# EAGLE design LZ3003_2 (EAGLE 7.7.0)
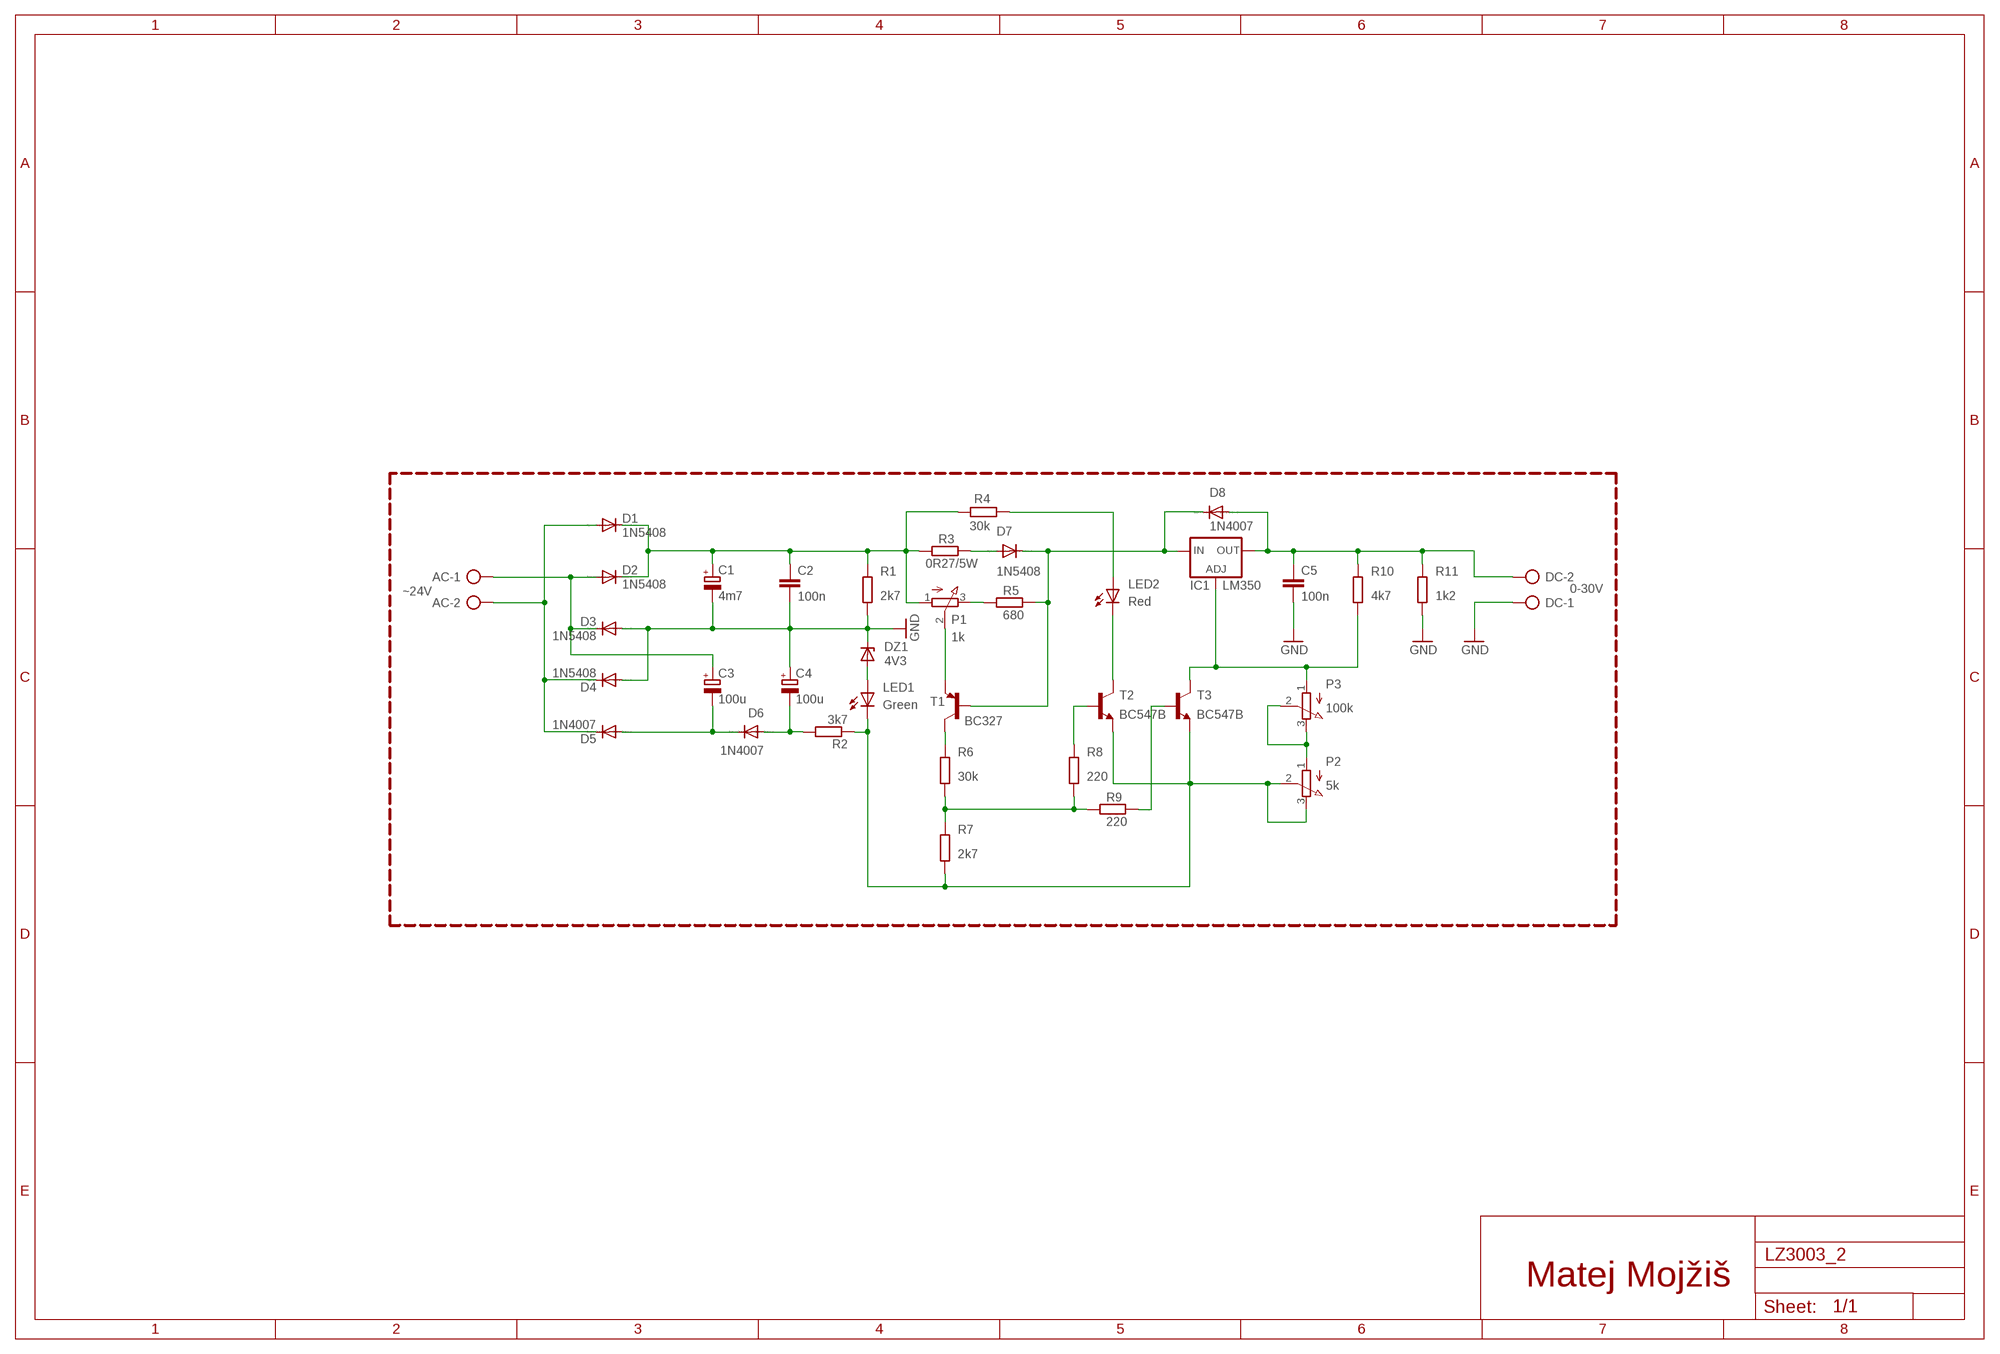
[diagram p0: schematic, sheet 1]

## Parts
AC  ~24V  W237-102  [W237-102]
C1  4m7  CPOL-EUE7.5-16  [E7,5-16]
C2  100n  C-EU050-025X075  [C050-025X075]
C3  100u  CPOL-EUE5-8.5  [E5-8,5]
C4  100u  CPOL-EUE5-8.5  [E5-8,5]
C5  100n  C-EU050-025X075  [C050-025X075]
D1  1N5408  1N5400  [DO201-15]
D2  1N5408  1N5400  [DO201-15]
D3  1N5408  1N5400  [DO201-15]
D4  1N5408  1N5400  [DO201-15]
D5  1N4007  1N4004  [DO41-10]
D6  1N4007  1N4004  [DO41-10]
D7  1N5408  1N5400  [DO201-15]
D8  1N4007  1N4004  [DO41-10]
DC  0-30V  W237-102  [W237-102]
DZ1  4V3  ZENER-DIODEDO34-7  [DO34Z7]
IC1  LM350  LM317TS  [317TS]
LED1  Green  LED5MM  [LED5MM]
LED2  Red  LED5MM  [LED5MM]
P1  1k  3RP/1610N  [3RP/1610N]
P2  5k  3RP/1610N  [3RP/1610N]
P3  100k  3RP/1610N  [3RP/1610N]
R1  2k7  R-EU_0207/7  [0207/7]
R2  3k7  R-EU_0207/7  [0207/7]
R3  0R27/5W  R-EU_0617/22  [0617/22]
R4  30k  R-EU_0207/7  [0207/7]
R5  680  R-EU_0207/7  [0207/7]
R6  30k  R-EU_0207/7  [0207/7]
R7  2k7  R-EU_0207/7  [0207/7]
R8  220  R-EU_0207/7  [0207/7]
R9  220  R-EU_0207/7  [0207/7]
R10  4k7  R-EU_0207/7  [0207/7]
R11  1k2  R-EU_0207/7  [0207/7]
T1  BC327  [TO92-EBC]
T2  BC547B  BC547B-NPN-TO92-CBE  [TO92-CBE]
T3  BC547B  BC547B-NPN-TO92-CBE  [TO92-CBE]

## Nets
GND: C1.- C2.2 C4.+ C5.2 D3.A D4.A DC.1 DZ1.C R1.2 R11.1
N$1: C3.- D5.A D6.C
N$2: D7.A R3.2
N$3: AC.1 C3.+ D2.A D3.C
N$4: P1.3(E) R5.1
N$5: AC.2 D1.A D4.C D5.C
N$6: C4.- D6.A R2.2
N$7: DZ1.A LED1.A
N$8: LED1.K(C) P2.2(S) P2.3(E) R2.1 R7.1 T2.E T3.E
N$9: C1.+ C2.1 D1.C D2.C P1.1(A) R1.1 R3.1 R4.2
N$10: P1.2(S) T1.E
N$11: R6.2 T1.C
N$12: R6.1 R7.2 R8.1 R9.1
N$13: R9.2 T3.B
N$14: R8.2 T2.B
N$16: P2.1(A) P3.2(S) P3.3(E)
N$20: LED2.A R4.1
N$21: D7.C D8.C IC1.3(IN) R5.2 T1.B
N$22: LED2.K(C) T2.C
N$24: C5.1 D8.A DC.2 IC1.2(OUT) R10.2 R11.2
N$26: IC1.1(ADJ) P3.1(A) R10.1 T3.C

## Notes on the sheet
- Matej Mojžiš

## Library data of the parts
AC DC = con-wago-500:W237-102: WAGO SCREW CLAMP; MPN: 237-102; OC_FARNELL: unknown; OC_NEWARK: 70K9898
C1 C3 C4 = rcl:CPOL-EU: POLARIZED CAPACITOR, European symbol
C2 C5 = rcl:C-EU: CAPACITOR, European symbol
D1-D4 D7 = diode:1N5400: DIODE standard rectifier, 3 A, 50 V (Motorola)
D5 D6 D8 = diode:1N4004: DIODE general purpose rectifier, 1 A
DZ1 = diode:ZENER-DIODE: Z-Diode
IC1 = v-reg:LM317TS: VOLTAGE REGULATOR
LED1 LED2 = led:LED: LED OSRAM: - CHIPLED LG R971, LG N971, LY N971, LG Q971, LY Q971, LO R971, LY R971 LH N974, LH R974 LS Q976, LO Q976, LY Q976 LO Q996 - Hyper CHIPLED LW Q18S LB Q993, LB Q99A, LB R99A - SideLED LS A670, LO A670, LY A670, LG A670, LP A670 LB A673, LV A673, LT A673, LW A673 LH A674 LY A675 LS A676, LA A676, LO A676, LY A676, LW A676 LS A679, LY A679, LG A679 - Hyper Micro SIDELED® LS Y876, LA Y876, LO Y876, LY Y876 LT Y87S - SmartLED LW L88C, LW L88S LB L89C, LB L89S, LG L890 LS L89K, LO L89K, LY L89K LS L896, LA L896, LO L896, LY L896 - TOPLED LS T670, LO T670, LY T670, LG T670, LP T670 LSG T670, LSP T670, LSY T670, LOP T670, LYG T670 LG T671, LOG T671, LSG T671 LB T673, LV T673, LT T673, LW T673 LH T674 LS T676, LA T676, LO T676, LY T676, LB T676, LH T676, LSB T676, LW T676 LB T67C, LV T67C, LT T67C, LS T67K, LO T67K, LY T67K, LW E67C LS E67B, LA E67B, LO E67B, LY E67B, LB E67C, LV E67C, LT E67C LW T67C LS T679, LY T679, LG T679 LS T770, LO T770, LY T770, LG T770, LP T770 LB T773, LV T773, LT T773, LW T773 LH T774 LS E675, LA E675, LY E675, LS T675 LS T776, LA T776, LO T776, LY T776, LB T776 LHGB T686 LT T68C, LB T68C - Hyper Mini TOPLED® LB M676 - Mini TOPLED Santana® LG M470 LS M47K, LO M47K, LY M47K Source: http://www.osram.convergy.de LUXEON: - LUMILED® LXK2-PW12-R00, LXK2-PW12-S00, LXK2-PW14-U00, LXK2-PW14-V00 LXK2-PM12-R00, LXK2-PM12-S00, LXK2-PM14-U00 LXK2-PE12-Q00, LXK2-PE12-R00, LXK2-PE12-S00, LXK2-PE14-T00, LXK2-PE14-U00 LXK2-PB12-K00, LXK2-PB12-L00, LXK2-PB12-M00, LXK2-PB14-N00, LXK2-PB14-P00, LXK2-PB14-Q00 LXK2-PR12-L00, LXK2-PR12-M00, LXK2-PR14-Q00, LXK2-PR14-R00 LXK2-PD12-Q00, LXK2-PD12-R00, LXK2-PD12-S00 LXK2-PH12-R00, LXK2-PH12-S00 LXK2-PL12-P00, LXK2-PL12-Q00, LXK2-PL12-R00 Source: www.luxeon.com KINGBRIGHT: KA-3528ASYC Source: www.kingbright.com
P1-P3 = pot:3RP/1610N: 16mm Potentiometer one level Source: http://www.alphapotentiometers.net/html/16mm_pot_2.html
R1-R11 = rcl:R-EU_: RESISTOR, European symbol
T1 = transistor-pnp:BC327*: PNP Transistror
T2 T3 = transistor:*-NPN-: NPN Transistror BF959 corrected 2008.03.06

## Board
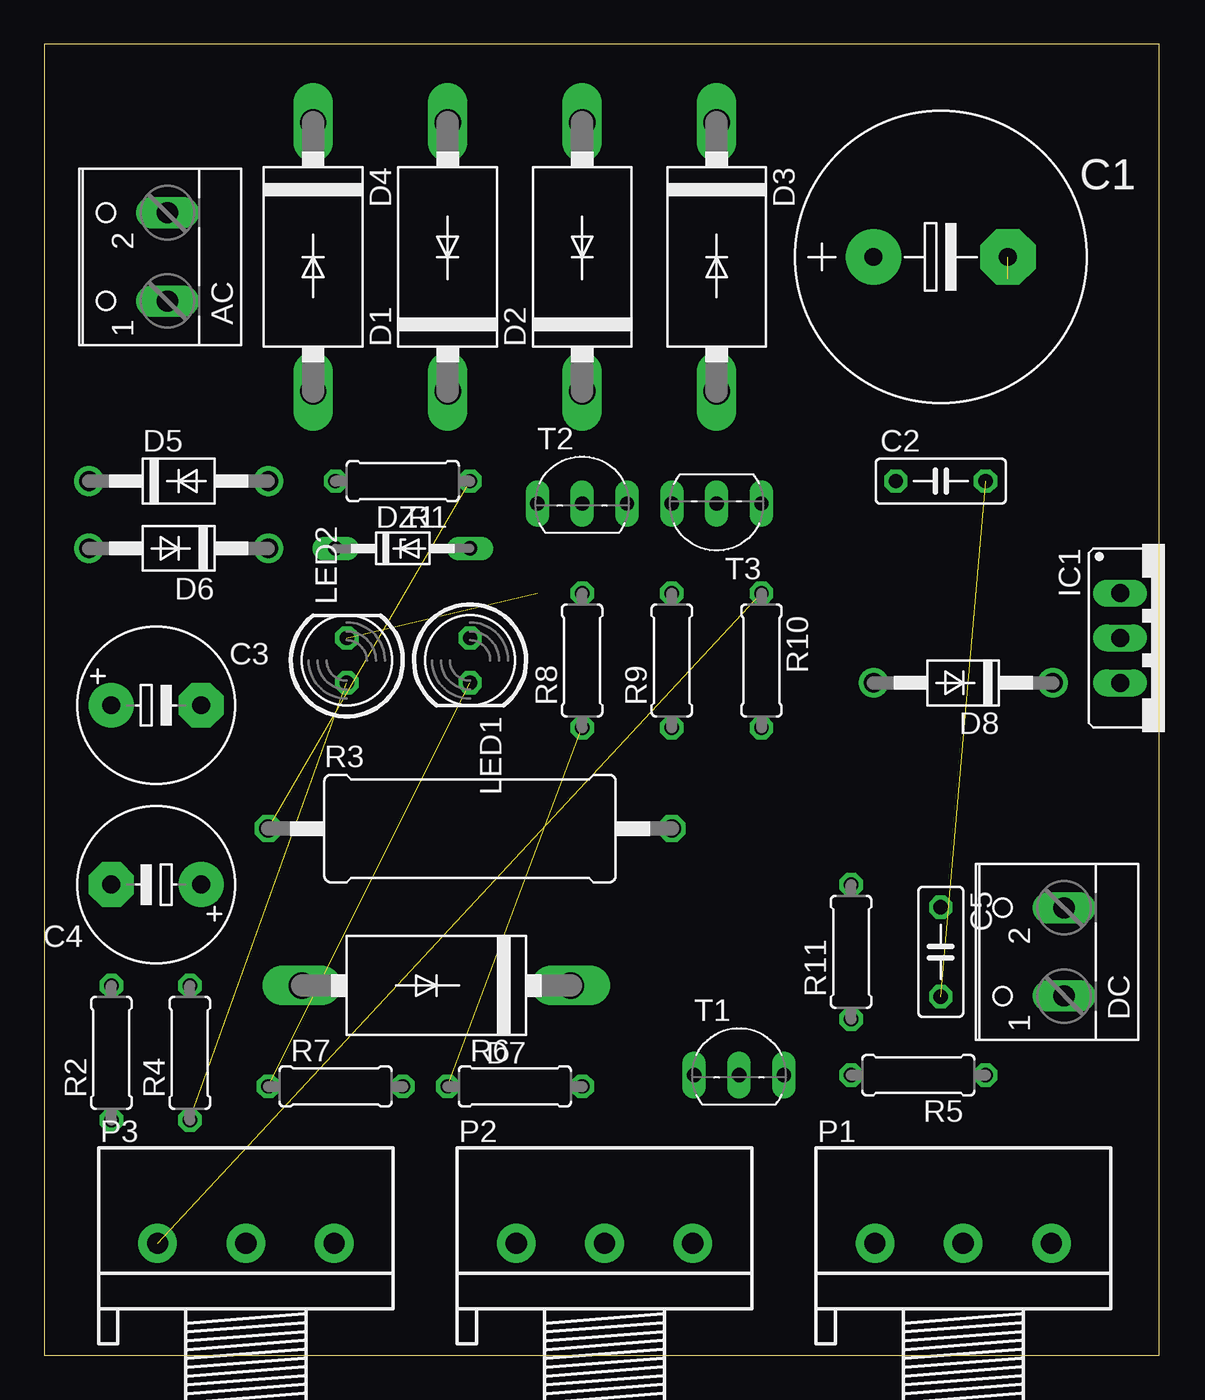
[diagram p1: board, top side]
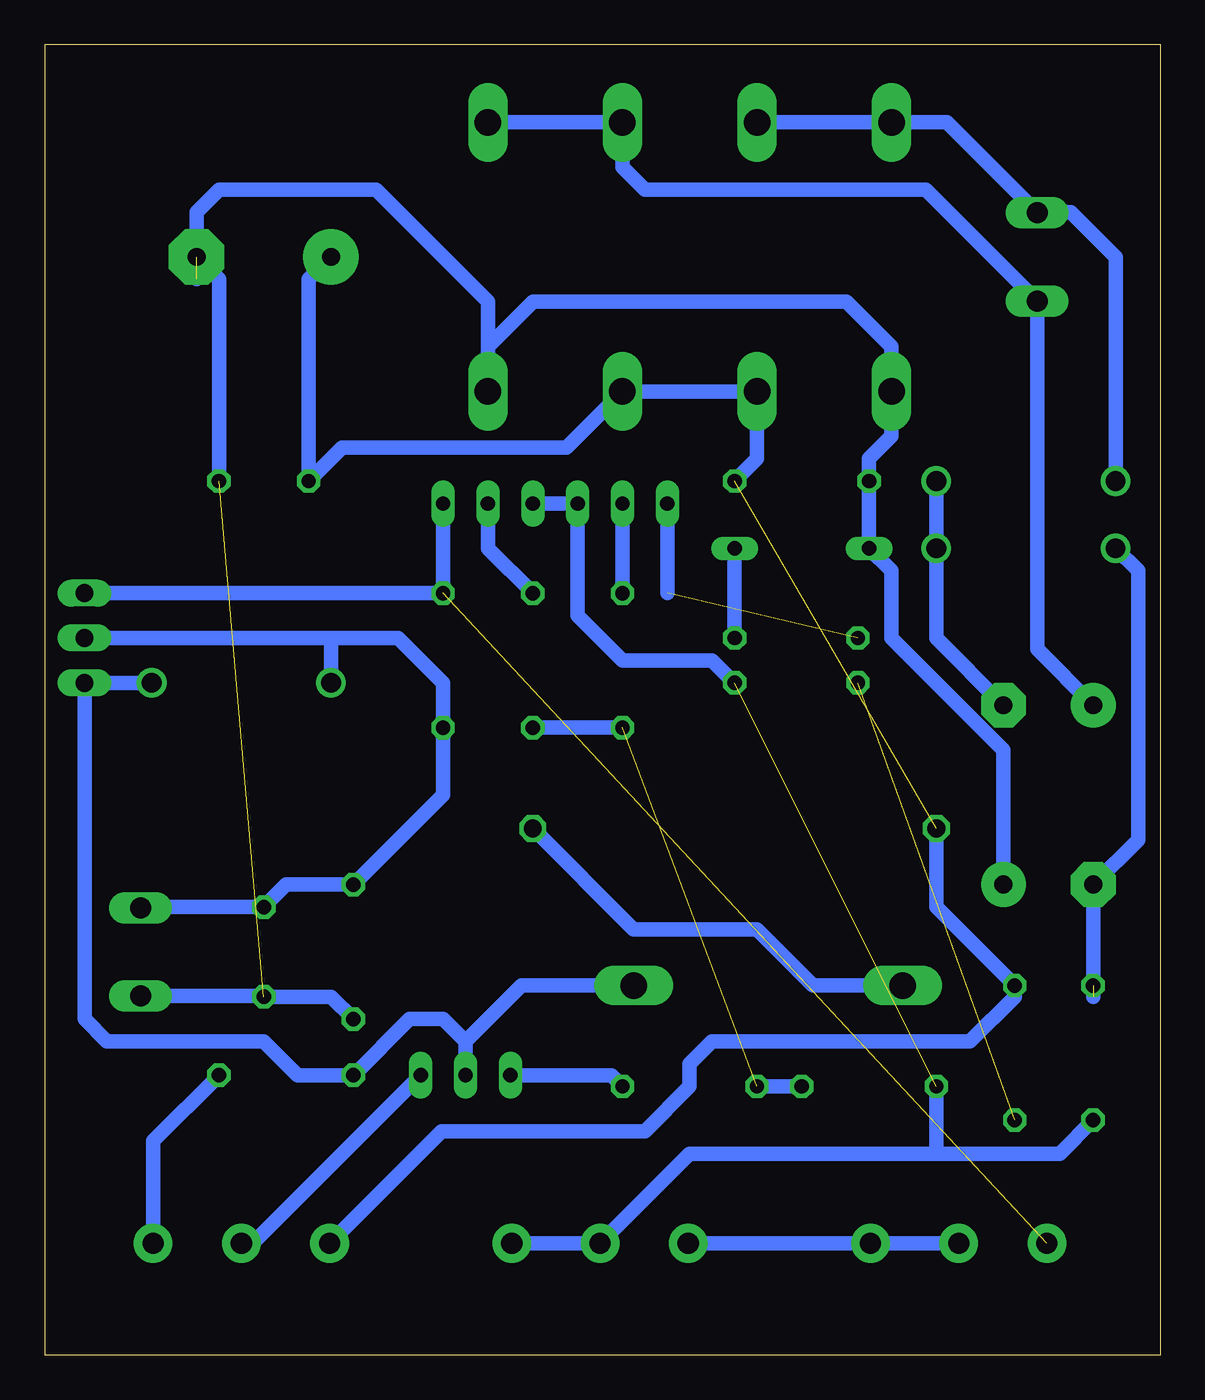
[diagram p2: board, bottom side, seen from below]

Size 63.17 x 74.28 mm. Coordinates in mm from the lower left corner, seen from the top.
Outline: 0,0 63.17,0 63.17,74.28 0,74.28 0,0
Copper layers (1*16): Top 0.035mm / dielectric 1.5mm / Bottom 0.035mm
Design rules "default": minimum track width 10mil, minimum drill 24mil, track to track 8mil, track to pad 8mil, pad to pad 8mil, via to via 8mil, smd to smd 8mil, copper to edge 40mil, drill to drill 8mil, minimum pad ring 10mil, minimum via ring 8mil, stop-mask expansion 4mil, vias tented up to drill 0mil, thermal gap 10mil

### Footprints (pad centres in the part's own frame; a part is rotated, then mirrored left to right if it is on the bottom)
W237-102 = drill 1.194 long: 1 -2.5,-1.27; 2 2.5,-1.27
E7,5-16 = drill 1.016 pad 3.15: + -3.81,0 | drill 1.016 pad 3.15 octagon: - 3.81,0
C050-025X075 = drill 0.813 octagon: 1 -2.54,0; 2 2.54,0
E5-8,5 = drill 1.016 pad 2.54: + -2.54,0 | drill 1.016 pad 2.54 octagon: - 2.54,0
DO201-15 = drill 1.499 long: A 7.62,0; C -7.62,0
DO41-10 = drill 1.118: A 5.08,0; C -5.08,0
DO34Z7 = drill 0.813 long: A 3.81,0; C -3.81,0
317TS = drill 1.016 long: 1 -2.54,-2.54; 2 0,-2.54; 3 2.54,-2.54
LED5MM = drill 0.813 octagon: A -1.27,0; K 1.27,0
3RP/1610N = drill 1.2 pad 2.184: 1 -5,0; 2 0,0; 3 5,0
0207/7 = drill 0.813 octagon: 1 -3.81,0; 2 3.81,0
0617/22 = drill 1.016 octagon: 1 -11.43,0; 2 11.43,0
TO92-EBC = drill 0.813 long: B 0,-1.27; C -2.54,-1.27; E 2.54,-1.27
TO92-CBE = drill 0.813 long: B 0,0; C -2.54,0; E 2.54,0

### Placement (x,y rotation side)
AC  5.71,62.23 90 top
C1  50.8,62.23 0 top
C2  50.8,49.53 0 top
C3  6.35,36.83 0 top
C4  6.35,26.67 180 top
C5  50.8,22.86 270 top
D1  22.86,62.23 90 top
D2  30.48,62.23 90 top
D3  38.1,62.23 270 top
D4  15.24,62.23 270 top
D5  7.62,49.53 0 top
D6  7.62,45.72 180 top
D7  22.23,20.95 180 top
D8  52.07,38.1 180 top
DC  56.52,22.86 90 top
DZ1  20.32,45.72 0 top
IC1  63.5,40.64 270 top
LED1  24.13,39.37 270 top
LED2  17.14,39.37 90 top
P1  52.07,6.35 0 top
P2  31.75,6.35 0 top
P3  11.43,6.35 0 top
R1  20.32,49.53 180 top
R2  3.81,17.14 90 top
R3  24.13,29.84 0 top
R4  8.26,17.14 90 top
R5  49.53,15.88 180 top
R6  26.67,15.24 0 top
R7  16.51,15.24 0 top
R8  30.48,39.37 90 top
R9  35.56,39.37 90 top
R10  40.64,39.37 270 top
R11  45.72,22.86 90 top
T1  39.37,17.14 0 top
T2  30.48,48.26 0 top
T3  38.1,48.26 180 top

### Tracks (layer width: path | path; a pad name or v marks a point on that pad's centre or on a via)
GND  (2 unrouted)
  Bottom 0.813: C1.- 53.34,60.96 C2.2 | D3.A 38.1,57.15 | 38.1,57.15 35.56,59.69 17.78,59.69 15.24,57.15 D4.A 15.24,52.07 16.51,50.8 R1.2 DZ1.C 15.24,44.45 15.24,40.64 8.89,34.29 C4.+ | 38.1,57.15 38.1,59.69 44.45,66.04 53.34,66.04 54.61,64.77 54.61,60.96 | R11.1 46.99,20.32 C5.2 50.84,20.36 DC.1
N$1
  Bottom 0.813: C3.- 12.7,40.64 D6.C D5.A
N$2
  Bottom 0.813: R3.2 29.84,24.13 22.86,24.13 19.68,20.95 D7.A
N$3
  Bottom 0.813: D3.C D2.A 30.48,67.31 29.21,66.04 13.29,66.04 AC.1 6.99,40.01 C3.+
N$4
  Bottom 0.813: R5.1 57.07,12.14 P1.3
N$5
  Bottom 0.813: D1.A D4.C 12.11,69.85 AC.2 6.95,64.77 5.08,64.77 2.54,62.23 D5.C
N$6  (1 unrouted)
  Bottom 0.813: D6.A 1.27,44.45 1.27,29.21 C4.- 3.81,20.32
N$7
  Bottom 0.813: DZ1.A LED1.A
N$8  (1 unrouted)
  Bottom 0.813: P2.3 P2.2 26.67,11.43 12.7,11.43 | T3.E T2.E 33.02,41.91 30.48,39.37 25.4,39.37 LED1.K | R2.1 5.71,11.43 12.7,11.43 | R7.1 12.7,11.43
N$9  (1 unrouted)
  Bottom 0.813: R1.1 22.86,50.8 D1.C D2.C 33.66,51.44 46.35,51.44 C2.1 48.26,60.96 C1.+ | R3.1 12.7,25.4 R4.2 8.26,20.32 10.79,17.78 25.4,17.78 26.67,16.51 26.67,15.24 29.21,12.7 40.72,12.7 P1.1
N$10
  Bottom 0.813: T1.E 51.44,6.35 P1.2
N$11
  Bottom 0.813: R6.2 31.11,15.88 T1.C
N$12  (1 unrouted)
  Bottom 0.813: R6.1 R7.2 | R8.1 R9.1
N$13
  Bottom 0.813: R9.2 38.1,45.72 T3.B
N$14
  Bottom 0.813: R8.2 T2.B
N$16
  Bottom 0.813: P3.2 P3.3 P2.1
N$20  (1 unrouted)
N$21
  Bottom 0.813: D8.C IC1.3 60.96,19.05 59.69,17.78 50.8,17.78 48.9,15.88 R5.2 42.55,19.05 40.64,19.05 39.37,17.78 | T1.B 39.37,17.78 | 39.37,17.78 36.2,20.95 D7.C
N$22  (1 unrouted)
  Bottom 0.813: 27.94,43.18 T2.C
N$24
  Bottom 0.813: IC1.2 46.99,40.64 | 46.99,40.64 43.18,40.64 40.64,38.1 R10.2 40.64,31.75 R11.2 49.53,26.67 C5.1 57.74,25.4 DC.2 | D8.A 46.99,40.64
N$26  (1 unrouted)
  Bottom 0.813: IC1.1 R10.1 T3.C